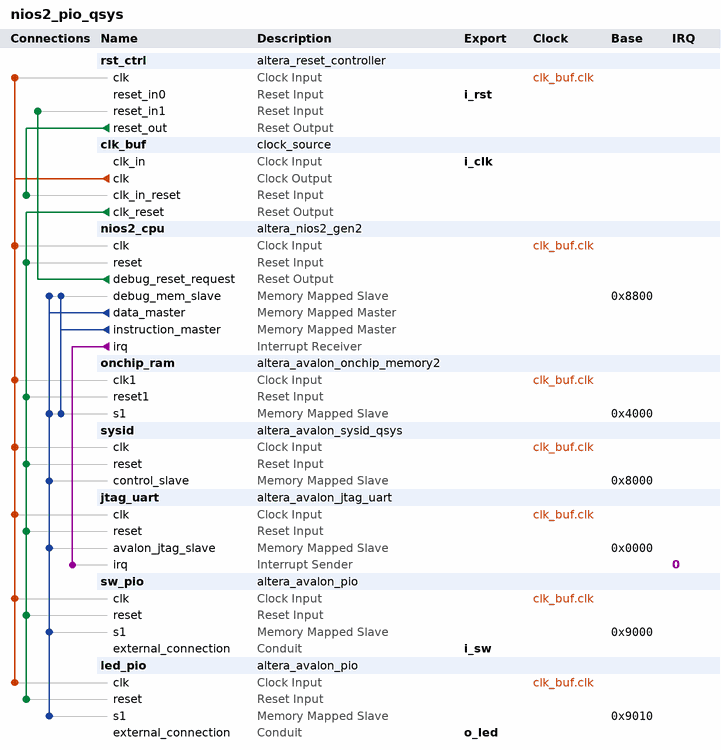
[diagram p0: system contents]
# Platform Designer (Qsys) system nios2_pio_qsys, MAX 10 10M16SAU169C8G
# Parameters at their usual value, and those the tool derives, are not listed.
package require -exact qsys 18.0
create_system nios2_pio_qsys
set_project_property DEVICE_FAMILY {MAX 10}
set_project_property DEVICE 10M16SAU169C8G

add_instance rst_ctrl altera_reset_controller 18.0
set_instance_parameter_value rst_ctrl NUM_RESET_INPUTS 2
set_instance_parameter_value rst_ctrl SYNC_DEPTH 2

add_instance clk_buf clock_source 18.0
set_instance_parameter_value clk_buf clockFrequency 20000000

add_instance nios2_cpu altera_nios2_gen2 18.0
set_instance_parameter_value nios2_cpu dcache_size 0
set_instance_parameter_value nios2_cpu exceptionSlave onchip_ram.s1
set_instance_parameter_value nios2_cpu icache_size 0
set_instance_parameter_value nios2_cpu impl Fast
set_instance_parameter_value nios2_cpu resetSlave onchip_ram.s1

add_instance onchip_ram altera_avalon_onchip_memory2 18.0
set_instance_parameter_value onchip_ram dataWidth 32
set_instance_parameter_value onchip_ram dualPort false
set_instance_parameter_value onchip_ram initMemContent false
set_instance_parameter_value onchip_ram initializationFileName onchip_mem.hex
set_instance_parameter_value onchip_ram memorySize 16384

add_instance sysid altera_avalon_sysid_qsys 18.0
set_instance_parameter_value sysid id -1162215168

add_instance jtag_uart altera_avalon_jtag_uart 18.0
set_instance_parameter_value jtag_uart simInteractiveOptions NO_INTERACTIVE_WINDOWS

add_instance sw_pio altera_avalon_pio 18.0
set_instance_parameter_value sw_pio direction Input
set_instance_parameter_value sw_pio width 8

add_instance led_pio altera_avalon_pio 18.0
set_instance_parameter_value led_pio direction Output
set_instance_parameter_value led_pio resetValue 5
set_instance_parameter_value led_pio width 8

# connections
add_connection clk_buf.clk jtag_uart.clk clock
add_connection clk_buf.clk led_pio.clk clock
add_connection clk_buf.clk nios2_cpu.clk clock
add_connection clk_buf.clk onchip_ram.clk1 clock
add_connection clk_buf.clk rst_ctrl.clk clock
add_connection clk_buf.clk sw_pio.clk clock
add_connection clk_buf.clk sysid.clk clock
add_connection clk_buf.clk_reset jtag_uart.reset reset
add_connection clk_buf.clk_reset led_pio.reset reset
add_connection clk_buf.clk_reset nios2_cpu.reset reset
add_connection clk_buf.clk_reset onchip_ram.reset1 reset
add_connection clk_buf.clk_reset sw_pio.reset reset
add_connection clk_buf.clk_reset sysid.reset reset
add_connection nios2_cpu.debug_reset_request rst_ctrl.reset_in1 reset
add_connection rst_ctrl.reset_out clk_buf.clk_in_reset reset
add_connection nios2_cpu.data_master jtag_uart.avalon_jtag_slave avalon
set_connection_parameter_value nios2_cpu.data_master/jtag_uart.avalon_jtag_slave baseAddress 0x0000
add_connection nios2_cpu.data_master led_pio.s1 avalon
set_connection_parameter_value nios2_cpu.data_master/led_pio.s1 baseAddress 0x9010
add_connection nios2_cpu.data_master nios2_cpu.debug_mem_slave avalon
set_connection_parameter_value nios2_cpu.data_master/nios2_cpu.debug_mem_slave baseAddress 0x8800
add_connection nios2_cpu.data_master onchip_ram.s1 avalon
set_connection_parameter_value nios2_cpu.data_master/onchip_ram.s1 baseAddress 0x4000
add_connection nios2_cpu.data_master sw_pio.s1 avalon
set_connection_parameter_value nios2_cpu.data_master/sw_pio.s1 baseAddress 0x9000
add_connection nios2_cpu.data_master sysid.control_slave avalon
set_connection_parameter_value nios2_cpu.data_master/sysid.control_slave baseAddress 0x8000
add_connection nios2_cpu.instruction_master nios2_cpu.debug_mem_slave avalon
set_connection_parameter_value nios2_cpu.instruction_master/nios2_cpu.debug_mem_slave baseAddress 0x8800
add_connection nios2_cpu.instruction_master onchip_ram.s1 avalon
set_connection_parameter_value nios2_cpu.instruction_master/onchip_ram.s1 baseAddress 0x4000
add_connection nios2_cpu.irq jtag_uart.irq interrupt
set_connection_parameter_value nios2_cpu.irq/jtag_uart.irq irqNumber 0

# exported interfaces
add_interface i_clk clock sink
set_interface_property i_clk EXPORT_OF clk_buf.clk_in
add_interface i_rst reset sink
set_interface_property i_rst EXPORT_OF rst_ctrl.reset_in0
add_interface i_sw conduit end
set_interface_property i_sw EXPORT_OF sw_pio.external_connection
add_interface o_led conduit end
set_interface_property o_led EXPORT_OF led_pio.external_connection

set_interconnect_requirement {$system} qsys_mm.clockCrossingAdapter HANDSHAKE
set_interconnect_requirement {$system} qsys_mm.enableEccProtection FALSE
set_interconnect_requirement {$system} qsys_mm.insertDefaultSlave FALSE
set_interconnect_requirement {$system} qsys_mm.maxAdditionalLatency 1

save_system nios2_pio_qsys.qsys
